# Altium schematic sheet Audio-Amplifier.SchDoc
size A4; DocumentNumber: 5; SheetNumber: 5; SheetTotal: 5
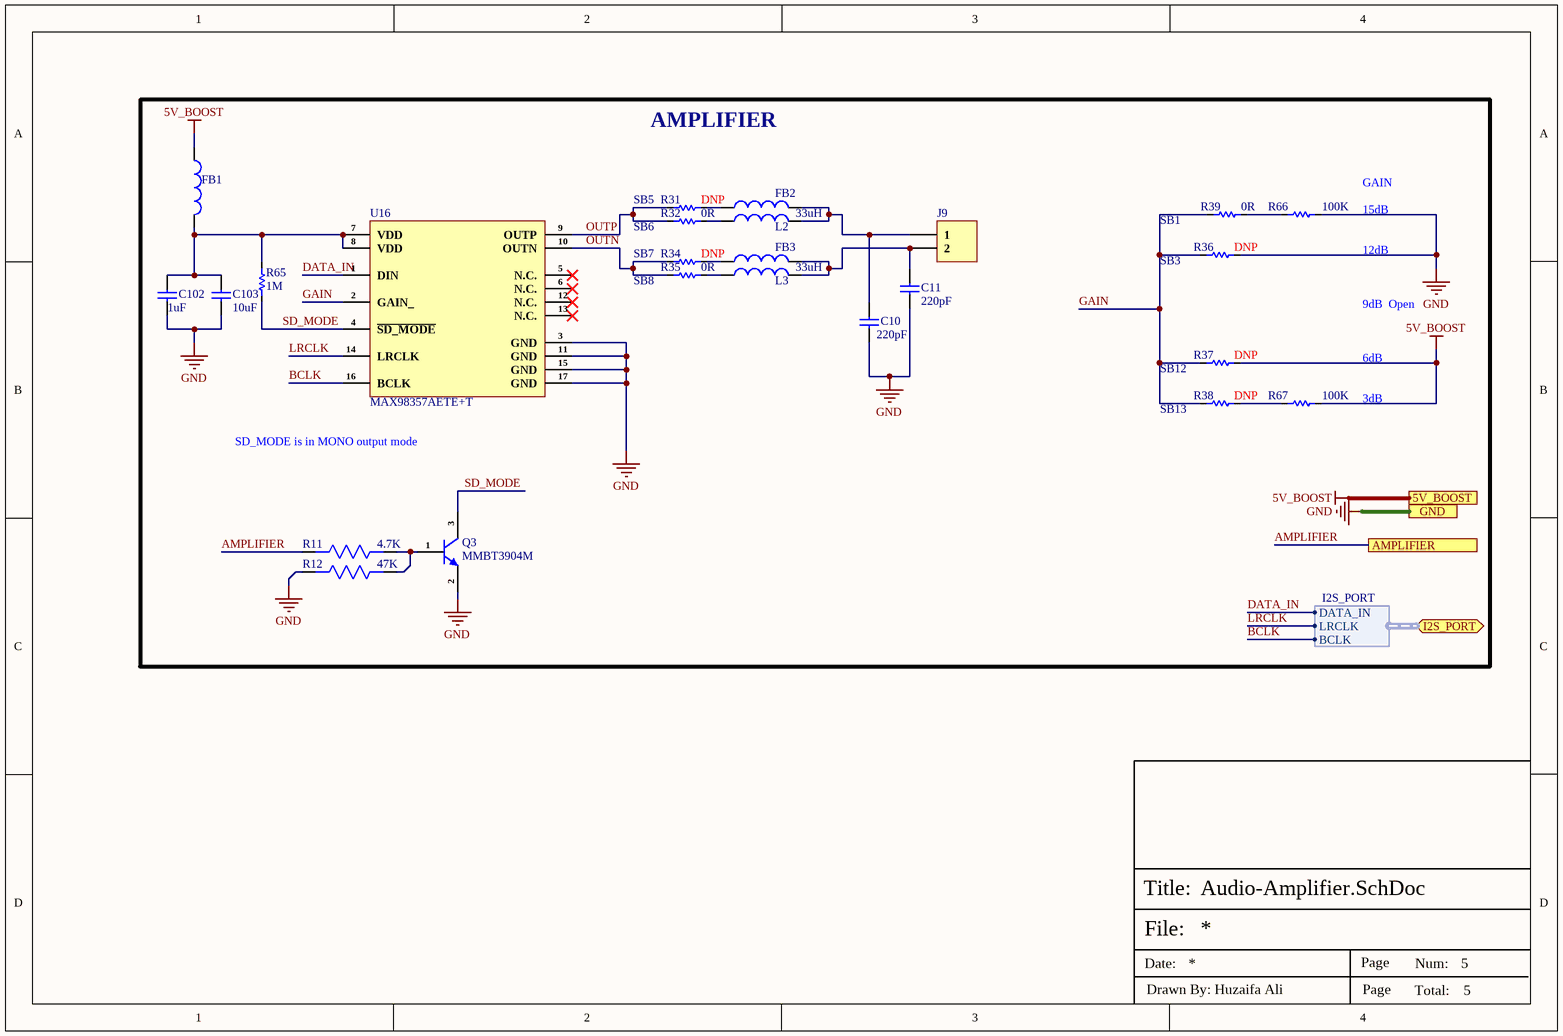
[diagram p0: Audio-Amplifier.SchDoc]

## Parts
C10  220pF  [Cap-0402]
C11  220pF  [Cap-0402]
C102  1uF  [Cap-0603]
C103  10uF  [Cap-0805]
FB1  BLM18PG300SN1D  [IND-0603 (1608 Metric)]  (value not drawn)
FB2  BLM18PG300SN1D  [IND-0603 (1608 Metric)]  (value not drawn)
FB3  BLM18PG300SN1D  [IND-0603 (1608 Metric)]  (value not drawn)
J9  61300211121  [HDR1X2_]  (value not drawn)
L2  33uH  [VLCF5024T-330MR50-2]
L3  33uH  [VLCF5024T-330MR50-2]
Q3  MMBT3904M  [SOT-723]
R11  4.7K  [Res-0603]
R12  47K  [Res-0603]
R31  DNP  [Res-0603]
R32  0R  [Res-0603]
R34  DNP  [Res-0603]
R35  0R  [Res-0603]
R36  DNP  [Res-0603]
R37  DNP  [Res-0603]
R38  DNP  [Res-0603]
R39  0R  [Res-0603]
R65  1M  [Res-0603]
R66  100K  [Res-0603]
R67  100K  [Res-0603]
U16  MAX98357AETE+T  [TQFN-16-EP(3x3)]

## Ports
5V_BOOST, AMPLIFIER, GND, I2S_PORT (bidir, harness I2S_PORT)

## Harnesses
I2S_PORT: DATA_IN, LRCLK, BCLK

## Nets
5V_BOOST: FB1.1 R37.2 R67.2 ; port 5V_BOOST
GND: C10.1 C11.1 C102.1 C103.1 Q3.2(E) R12.2 R36.2 R66.2 U16.3(GND) U16.11(GND) U16.15(GND) U16.17(GND) ; port GND
AMPLIFIER: R11.2 ; port AMPLIFIER
BCLK: U16.16(BCLK) ; port I2S_PORT.BCLK
DATA_IN: U16.1(DIN) ; port I2S_PORT.DATA_IN
GAIN: R36.1 R37.1 R38.1 R39.1 U16.2(GAIN_)
LRCLK: U16.14(LRCLK) ; port I2S_PORT.LRCLK
OUTN: R34.1 R35.1 U16.10(OUTN)
OUTP: R31.1 R32.1 U16.9(OUTP)
SD_MODE: Q3.3(C) R65.1 U16.4(~{SD_MODE})
NetC10_2: C10.2 FB2.2 J9.1 L2.2
NetC11_2: C11.2 FB3.2 J9.2 L3.2
NetC102_2: C102.2 C103.2 FB1.2 R65.2 U16.7(VDD) U16.8(VDD)
NetFB2_1: FB2.1 R31.2
NetFB3_1: FB3.1 R34.2
NetL2_1: L2.1 R32.2
NetL3_1: L3.1 R35.2
NetQ3_1: Q3.1(B) R11.1 R12.1
NetR38_2: R38.2 R67.1
NetR39_2: R39.2 R66.1

Not connected (* = marked no-connect by the designer): U16 5(N.C.)* 6(N.C.)* 12(N.C.)* 13(N.C.)*

## Notes on the sheet
- AMPLIFIER
- SB5
- SB6
- SB1
- SB7
- SB8
- (near R36) SB3
- SB12
- (near U16) SD_MODE is in MONO output mode
- (near R38) SB13
- GAIN
  15dB
  12dB
  9dB  Open
  6dB
  3dB
- File:
- Title:
- Date:
- Page
- Num:
- Total:
- Drawn By: Huzaifa Ali

## Library data of the parts
C10 C11 = CC0402JRNPO9BN221: CAP CER 220PF 50V C0G/NPO 0402; Manufacturer: Yageo; Dielectric Material: Ceramic; Tolerance: 10%; Dielectric: C0G; Temperature Coefficient: 30ppm/°C; Insulation Resistance: 10GR; Dissipation Factor: 0.1%; Supplier 1: RSComponents; Manufacturer Part Number: CC0402JRNPO9BN221; RoHS: Yes; Category: Ceramic Capacitors; Stock 1: 20000; Pricing 1: 10000=0.00600, 100000=0.00600 (GBP); Mount: Surface Mount; Case/Package: 0402; Number of Pins: 2; Case Code (Metric): 1005; Case Code (Imperial): 0402; Min Operating Temperature: -55°C; Max Operating Temperature: 125°C; Capacitance: 220pF; Package Quantity: 1; Voltage Rating: 50V; Packaging: Tape and Reel; Termination: SMD/SMT; Voltage: 50V; Series: CC; Length: 1mm; Width: 0.02inch; Height: 0.5mm; Thickness: 0.022inch; Depth: 0.5mm; Radiation Hardening: No; RoHS Compliant: Yes; REACH SVHC: No SVHC; Lead Free: Lead Free; ComponentLink1URL: https://datasheet.ciiva.com/11786/0900766b8079c870-11786154.pdf?src-supplier=RSComponents; ComponentLink1Description: https://datasheet.ciiva.com/11786/0900766b8079c870-11786154.pdf?src-supplier=RSComponents; ComponentLink2URL: https://datasheet.ciiva.com/7656/1132289-7656616.pdf?src-supplier=Element14; ComponentLink2Description: https://datasheet.ciiva.com/7656/1132289-7656616.pdf?src-supplier=Element14; ComponentLink3URL: https://datasheet.ciiva.com/8033/1443161-8033609.pdf?src-supplier=Element14; ComponentLink3Description: https://datasheet.ciiva.com/8033/1443161-8033609.pdf?src-supplier=Element14; ComponentLink4URL: https://datasheet.ciiva.com/8033/1443161-8033608.pdf?src-supplier=Element14; ComponentLink4Description: https://datasheet.ciiva.com/8033/1443161-8033608.pdf?src-supplier=Element14; ComponentLink5URL: https://datasheet.ciiva.com/176/mlccorderingcode-176384.pdf?src-supplier=Digi-Key; ComponentLink5Description: https://datasheet.ciiva.com/176/mlccorderingcode-176384.pdf?src-supplier=Digi-Key; ComponentLink6URL: https://datasheet.ciiva.com/176/mlccorderingcode-176383.pdf?src-supplier=Digi-Key; ComponentLink6Description: https://datasheet.ciiva.com/176/mlccorderingcode-176383.pdf?src-supplier=Digi-Key; ComponentLink7URL: https://datasheet.ciiva.com/176/mlccorderingcode-176385.pdf?src-supplier=Digi-Key; ComponentLink7Description: https://datasheet.ciiva.com/176/mlccorderingcode-176385.pdf?src-supplier=Digi-Key; ComponentLink8URL: https://datasheet.ciiva.com/17434/upy-gp-np0-16v-to-50v-8-17434343.pdf?src-supplier=Avnet+Europe; ComponentLink8Description: https://datasheet.ciiva.com/17434/upy-gp-np0-16v-to-50v-8-17434343.pdf?src-supplier=Avnet+Europe; Supplier Part Number 1: 6169284; LCSC Part Number: C107001
C102 = CC0603KRX5R8BB105: CAP CER 1UF 25V X5R 0603; Manufacturer: Yageo; Tolerance: 10%; Item Type: Capacitor; Supplier 1: Digi-Key; Manufacturer Part Number: CC0603KRX5R8BB105; RoHS: Yes; Category: Ceramic Capacitors; Stock 1: 919939; Pricing 1: 1=0.12000, 10=0.08400, 50=0.04760, 100=0.03940, 500=0.02764, 1000=0.02288 (USD); Mount: Surface Mount; Case/Package: 0603; Number of Pins: 2; Case Code (Metric): 1608; Case Code (Imperial): 0603; Min Operating Temperature: -55°C; Max Operating Temperature: 85°C; Capacitance: 1uF; Dielectric: X5R; Package Quantity: 1; Voltage Rating: 25V; Packaging: Tape and Reel; Termination: SMD/SMT; Voltage Rating (DC): 25V; Series: CC; Construction: Flat; Length: 1.6mm; Width: 0.031inch; Height: 0.8mm; Thickness: 0.035inch; Depth: 0.8mm; Radiation Hardening: No; REACH SVHC: No SVHC; Lead Free: Lead Free; Halogen Free: Halogen Free; RoHS Compliant: Yes; ComponentLink1URL: https://datasheet.ciiva.com/176/mlccorderingcode-176785.pdf?src-supplier=Digi-Key; ComponentLink1Description: https://datasheet.ciiva.com/176/mlccorderingcode-176785.pdf?src-supplier=Digi-Key; ComponentLink2URL: https://datasheet.ciiva.com/176/mlccorderingcode-176786.pdf?src-supplier=Digi-Key; ComponentLink2Description: https://datasheet.ciiva.com/176/mlccorderingcode-176786.pdf?src-supplier=Digi-Key; ComponentLink3URL: https://datasheet.ciiva.com/176/mlccorderingcode-176787.pdf?src-supplier=Digi-Key; ComponentLink3Description: https://datasheet.ciiva.com/176/mlccorderingcode-176787.pdf?src-supplier=Digi-Key; ComponentLink4URL: https://datasheet.ciiva.com/17436/upy-gphc-x5r-4v-to-50v-12-17436952.pdf?src-supplier=Avnet+Europe; ComponentLink4Description: https://datasheet.ciiva.com/17436/upy-gphc-x5r-4v-to-50v-12-17436952.pdf?src-supplier=Avnet+Europe; ComponentLink5URL: https://datasheet.ciiva.com/7978/1525783-7978171.pdf?src-supplier=Element14; ComponentLink5Description: https://datasheet.ciiva.com/7978/1525783-7978171.pdf?src-supplier=Element14; ComponentLink6URL: https://datasheet.ciiva.com/11586/upy-gphc-x5r-4v-to-50v-12-11586318.pdf?src-supplier=Avnet; ComponentLink6Description: https://datasheet.ciiva.com/11586/upy-gphc-x5r-4v-to-50v-12-11586318.pdf?src-supplier=Avnet; Supplier Part Number 1: 311-1445-1-ND; LCSC Part Number: C14664
C103 = CC0805KKX5R8BB106: CAP CER 10UF 25V X5R 0805; Manufacturer: Yageo; Tolerance: 10%; Item Type: Capacitor; Supplier 1: Digi-Key; Manufacturer Part Number: CC0805KKX5R8BB106; RoHS: Yes; Category: Ceramic Capacitors; Stock 1: 554290; Pricing 1: 1=0.31000, 10=0.21200, 50=0.14820, 100=0.12710, 500=0.09534, 1000=0.08050 (USD); Mount: Surface Mount; Case/Package: 0805; Case Code (Imperial): 0805; Case Code (Metric): 2012; Weight: 0.000194oz; Min Operating Temperature: -55°C; Max Operating Temperature: 85°C; Capacitance: 10uF; Voltage Rating (DC): 25V; Packaging: Tape and Reel; Voltage Rating: 25V; Dielectric: X5R; Termination: SMD/SMT; Resistor Type: Ceramic; Series: CC; Length: 0.079inch; Width: 0.049inch; Thickness: 0.057inch; Depth: 1.25mm; Lead Free: Lead Free; Halogen Free: Halogen Free; RoHS Compliant: Yes; ComponentLink1URL: http://www.mouser.com/ds/2/447/UPY-GPHC_X5R_4V-to-50V_25-1131599.pdf?src-supplier=Mouser; ComponentLink1Description: http://www.mouser.com/ds/2/447/UPY-GPHC_X5R_4V-to-50V_25-1131599.pdf?src-supplier=Mouser; ComponentLink2URL: http://www.yageo.com/documents/recent/UPY-GPHC_X5R_4V-to-50V_25.pdf?src-supplier=Digi-Key; ComponentLink2Description: http://www.yageo.com/documents/recent/UPY-GPHC_X5R_4V-to-50V_25.pdf?src-supplier=Digi-Key; Supplier Part Number 1: 311-1869-1-ND; LCSC Part Number: C89831
FB1-FB3 = BLM18PG300SN1D: FERRITE BEAD 30 OHM 0603 1LN / Ferrite Beads Multi-Layer 30Ohm 100MHz 1A 0.05Ohm DCR 0603 T/R; Manufacturer: Murata; Material: Steel,Ferrite; Impedance: 30R; Tolerance: 25%; DC Resistance (DCR): 50mR; Number of Lines: 1; Shielding: Unshielded; Supplier 1: RSComponents; Manufacturer Part Number: BLM18PG300SN1D; RoHS: Yes; Category: Inductors; Stock 1: 3100; Pricing 1: 25=0.07200, 1000=0.06200, 2000=0.05400, 5000=0.04700, 10000=0.04300 (GBP); Case/Package: 0603; Number of Pins: 2; Core Material: Ferrite; Case Code (Metric): 1608; Case Code (Imperial): 0603; Min Operating Temperature: -55°C; Max Operating Temperature: 125°C; Package Quantity: 4000; Max Current Rating: 1A; Packaging: Tape and Reel; Current Rating: 1A; Max DC Current: 1A; Termination: SMD/SMT; Test Frequency: 100MHz; DC Current: 1A; Frequency: 100MHz; Number of Circuits: 1; Series: BLM18P; DC Resistance-Max: 50mR; Length: 1.6mm; Width: 0.8mm; Height: 0.8mm; Depth: 0.8mm; Radiation Hardening: No; REACH SVHC: No SVHC; Lead Free: Lead Free; RoHS Compliant: Yes; ComponentLink1URL: https://datasheet.ciiva.com/19460/1845048-19460200.pdf?src-supplier=Jameco; ComponentLink1Description: https://datasheet.ciiva.com/19460/1845048-19460200.pdf?src-supplier=Jameco; ComponentLink2URL: https://datasheet.ciiva.com/11800/0900766b81275ca5-11800868.pdf?src-supplier=RSComponents; ComponentLink2Description: https://datasheet.ciiva.com/11800/0900766b81275ca5-11800868.pdf?src-supplier=RSComponents; ComponentLink3URL: https://datasheet.ciiva.com/8021/5148-8021484.pdf?src-supplier=Element14; ComponentLink3Description: https://datasheet.ciiva.com/8021/5148-8021484.pdf?src-supplier=Element14; ComponentLink4URL: https://datasheet.ciiva.com/8021/5148-8021486.pdf?src-supplier=Element14; ComponentLink4Description: https://datasheet.ciiva.com/8021/5148-8021486.pdf?src-supplier=Element14; ComponentLink5URL: https://datasheet.ciiva.com/1012/l0110s0100blm18p-1012120.pdf?src-supplier=Digi-Key; ComponentLink5Description: https://datasheet.ciiva.com/1012/l0110s0100blm18p-1012120.pdf?src-supplier=Digi-Key; ComponentLink6URL: https://datasheet.ciiva.com/1012/l0110s0100blm18p-1012119.pdf?src-supplier=Digi-Key; ComponentLink6Description: https://datasheet.ciiva.com/1012/l0110s0100blm18p-1012119.pdf?src-supplier=Digi-Key; ComponentLink7URL: https://datasheet.ciiva.com/1012/l0110s0100blm18p-1012121.pdf?src-supplier=Digi-Key; ComponentLink7Description: https://datasheet.ciiva.com/1012/l0110s0100blm18p-1012121.pdf?src-supplier=Digi-Key; ComponentLink8URL: https://datasheet.ciiva.com/3081/l0110s0100blm18p-3081636.pdf?src-supplier=Avnet; ComponentLink8Description: https://datasheet.ciiva.com/3081/l0110s0100blm18p-3081636.pdf?src-supplier=Avnet; Supplier Part Number 1: 7241403; LCSC Part Number: C17305; Item Type: Ferrite Bead
J9 = 61300211121: CONN HEADER VERT 2POS 2.54MM; Manufacturer: Wurth Electronics; Current Rating: 3A; Voltage Rating: 250V; Number of Positions: 2; Gender: Male; Connector Type: Male Pin; Pitch: 0.1inch; Supplier 1: Digi-Key; Manufacturer Part Number: 61300211121; Stock 1: 219205; Pricing 1: 1=0.13, 10=0.106, 25=0.088, 50=0.074, 100=0.067, 1000=0.061 (USD); Mount: Through Hole; Contact Plating: Gold; Housing Material: PBT; Contact Material: Copper Alloy,Copper; Color: Black; Min Operating Temperature: -40°C; Max Operating Temperature: 125°C; Number of Rows: 1; Contact Gender: Male; Packaging: Bulk; Termination: Through Hole; Number of Contacts: 2; Contact Mating Length: 0.236inch; REACH SVHC: Unknown; Lead Free: Lead Free; ComponentLink1URL: http://www.mouser.com/ds/2/445/6130xx11121-538006.pdf?src-supplier=Mouser; ComponentLink1Description: http://www.mouser.com/ds/2/445/6130xx11121-538006.pdf?src-supplier=Mouser; Supplier Part Number 1: 732-5315-ND; Item Type: Header
L2 L3 = VLCF5024T-330MR50-2: FIXED IND 33UH 500MA 275MOHM SMD; Manufacturer: TDK; Core Material: Ferrite; Tolerance: 20%; Shielding: Shielded; DC Resistance (DCR): 275mR; Test Frequency: 100kHz; RMS Current (Irms): 1.24A; Item Type: Inductor; Supplier 1: Mouser; Manufacturer Part Number: VLCF5024T-330MR50-2; RoHS: Yes; Category: Fixed Inductors; Stock 1: 559; Pricing 1: 1=1.23000, 10=0.91900, 50=0.91900, 100=0.77200, 1000=0.57700, 10000=0.53200 (USD); Mounting Technology: Surface Mount; Case/Package: Nonstandard; Min Operating Temperature: -40°C; Max Operating Temperature: 105°C; Packaging: Cut Tape; Inductance Tolerance: 20%; Package Quantity: 500; Current Rating: 500mA; Saturation Current: 500mA; Resistor Type: Wirewound; Value: 33uH; Max DC Current: 500mA; Series: VLCF; Length: 0.197inch; Width: 0.197inch; Height: 2.4mm; Height - Seated (Max): 0.094inch; Reach SVHC Compliant: Yes; RoHS Compliant: Yes; ComponentLink1URL: https://datasheet.ciiva.com/22729/1724253-22729224.pdf?src-supplier=Element14; ComponentLink1Description: https://datasheet.ciiva.com/22729/1724253-22729224.pdf?src-supplier=Element14; Supplier Part Number 1: 810-VLCF524T330MR502; LCSC Part Number: C2046704
Q3 = MMBT3904M: 40V 100mW 100@10mA,1V 200mA 300MHz 300mV@50mA,5mA NPN -55℃~+150℃@(Tj) SOT-723 Bipolar Transistors - BJT ROHS; Manufacturer: TECH PUBLIC; Item Type: Mosfet; ComponentLink1Description: LCSC; ComponentLink1URL: https://www.lcsc.com/product-detail/Bipolar-Transistors-BJT_TECH-PUBLIC-MMBT3904M_C2923360.html; Manufacturer Part Number: MMBT3904M; Package: SOT-723; LCSC Part Number: C2923360
R11 = RC0603JR-074K7L: RES SMD 4.7K OHM 5% 1/10W 0603; Manufacturer: Yageo; Resistance: 4.7kR; Temperature Coefficient: 100ppm/°C; Voltage Rating (DC): 50V; Power Rating: 100mW; Supplier 1: Digi-Key; Manufacturer Part Number: RC0603JR-074K7L; Stock 1: 19706643; Pricing 1: 1=0.1, 10=0.02, 100=0.0081, 1000=0.00362, 2500=0.00314 (USD); Case/Package: 0603; Number of Pins: 2; Case Code (Imperial): 0603; Case Code (Metric): 1608; Min Operating Temperature: -55°C; Max Operating Temperature: 155°C; Tolerance: 5%; Composition: Thick Film; Packaging: Tape and Reel; Voltage Rating: 50V; Termination: SMD/SMT; Military Standard: Not; Length: 1.6mm; Width: 0.8mm; Depth: 0.8mm; REACH SVHC: No SVHC; Lead Free: Lead Free; ComponentLink1URL: http://www.farnell.com/datasheets/443971.pdf?src-supplier=Element14; ComponentLink1Description: http://www.farnell.com/datasheets/443971.pdf?src-supplier=Element14; Supplier Part Number 1: 311-4.7KGRCT-ND; LCSC Part Number: C105428
R12 = RC0603JR-0747KL: RES 47K OHM 5% 1/10W 0603; Manufacturer: Yageo; Resistance: 47kR; Power Rating: 100mW; Voltage Rating (DC): 50V; Temperature Coefficient: 100ppm/°C; Resistance Tolerance: 1%; Supplier 1: Arrow; Manufacturer Part Number: RC0603JR-0747KL; Stock 1: 599135; Pricing 1: 5000=0.0025, 10000=0.0022, 25000=0.0019, 1=0.0011, 6000=0.001 (USD); Case/Package: 0603; Number of Pins: 2; Case Code (Imperial): 0603; Case Code (Metric): 1608; Min Operating Temperature: -55°C; Max Operating Temperature: 155°C; Packaging: Tape and Reel; Tolerance: 5%; Voltage Rating: 50V; Package Quantity: 5000; Termination: SMD/SMT; Military Standard: Not; Composition: Thick Film; Length: 1.6mm; Height: 0.45mm; Width: 0.8mm; Depth: 0.8mm; REACH SVHC: No SVHC; Lead Free: Lead Free; ComponentLink1URL: http://www.farnell.com/datasheets/443971.pdf; ComponentLink1Description: http://www.farnell.com/datasheets/443971.pdf; ComponentLink2URL: http://www.mouser.com/catalog/specsheets/RC0603.pdf; ComponentLink2Description: http://www.mouser.com/catalog/specsheets/RC0603.pdf; Supplier Part Number 1: RC0603JR-0747KL; Supplier 2: Digi-Key; RoHS: Yes; Category: Chip SMD Resistors; Stock 2: 1087850; Pricing 2: 1=0.10000, 10=0.02300, 100=0.00930, 1000=0.00417, 2500=0.00362 (USD); Size Code: 0603; Number of Terminations: 2; Resistor Type: Thick Film; Features: Moisture Resistant; Series: RC; Max Power Dissipation: 100mW; Construction: Rectangular; RoHS Compliant: Yes; ComponentLink3URL: https://datasheet.ciiva.com/46395/443971-46395003.pdf?src-supplier=Element14; ComponentLink3Description: https://datasheet.ciiva.com/46395/443971-46395003.pdf?src-supplier=Element14; ComponentLink4URL: https://datasheet.ciiva.com/12558/rc0603-272842-12558744.pdf?src-supplier=Mouser; ComponentLink4Description: https://datasheet.ciiva.com/12558/rc0603-272842-12558744.pdf?src-supplier=Mouser; Supplier Part Number 2: 311-30.0KHRCT-ND; LCSC Part Number: C127447
R31 R32 R34-R39 = RC0603FR-070RL: RES SMD 0R, 1%, 0.1W, 0603; Manufacturer: Yageo; Item Type: Resistor; Manufacturer Part Number: RC0603FR-070RL; Package: 0603; LCSC Part Number: C100044; ComponentLink9Description: LCSC; ComponentLink9URL: https://www.lcsc.com/product-detail/Chip-Resistor-Surface-Mount_YAGEO-RC0603FR-070RL_C100044.html
R65 = RC0603FR-071ML: RES SMD 1M OHM 1% 1/10W 0603; Manufacturer: Yageo; Voltage Rating: 50V; Resistance: 1MR; Power Rating: 100mW; Temperature Coefficient: 100ppm/°C; Supplier 1: Digi-Key; Manufacturer Part Number: RC0603FR-071ML; Stock 1: 3824601; Pricing 1: 1=0.1, 10=0.023, 100=0.0094, 1000=0.00421, 2500=0.00366 (USD); Case/Package: 0603; Number of Pins: 2; Case Code (Imperial): 0603; Case Code (Metric): 1608; Min Operating Temperature: -55°C; Max Operating Temperature: 155°C; Voltage Rating (DC): 50V; Tolerance: 1%; Packaging: Tape and Reel; Package Quantity: 5000; Termination: SMD/SMT; Composition: Thick Film; Military Standard: Not; Length: 1.6mm; Height: 0.45mm; Width: 0.8mm; Depth: 0.8mm; REACH SVHC: No SVHC; Lead Free: Lead Free; ComponentLink1URL: http://www.farnell.com/datasheets/2167052.pdf?src-supplier=Mouser; ComponentLink1Description: http://www.farnell.com/datasheets/2167052.pdf?src-supplier=Mouser; ComponentLink2URL: http://www.farnell.com/datasheets/2167052.pdf?src-supplier=Element14; ComponentLink2Description: http://www.farnell.com/datasheets/2167052.pdf?src-supplier=Element14; ComponentLink3URL: http://documents.rs-components.com/techlib://itc_doclist_GB.htm?stockno=5048956&src-supplier=RSComponents; ComponentLink3Description: http://documents.rs-components.com/techlib://itc_doclist_GB.htm?stockno=5048956&src-supplier=RSComponents; Supplier Part Number 1: 311-1.00MHRDKR-ND; LCSC Part Number: C105578
R66 R67 = RT0603BRD07100KL: RES SMD 100K OHM 0.1% 1/10W 0603; Manufacturer: Yageo; Resistance: 100kR; Temperature Coefficient: 25ppm/°C; Voltage Rating (DC): 75V; Power Rating: 100mW; Item Type: Resistor; Supplier 1: Digi-Key; Manufacturer Part Number: RT0603BRD07100KL; Stock 1: 53395; Pricing 1: 1=0.39, 10=0.332, 100=0.1298, 1000=0.05435, 2500=0.04982 (USD); Mount: Surface Mount; Case/Package: 0603; Case Code (Imperial): 0603; Case Code (Metric): 1608; Min Operating Temperature: -55°C; Max Operating Temperature: 125°C; Tolerance: 0.1%; Composition: Thin Film; Packaging: Tape and Reel; Voltage Rating: 75V; Package Quantity: 5000; Termination: SMD/SMT; Number of Terminations: 2; Military Standard: Not; Max Power Dissipation: 100mW; Working Voltage: 75V; Features: Moisture Resistant; Length: 1.6mm; Height: 0.022inch; Width: 0.031inch; Depth: 0.8mm; Lead Free: Lead Free; ComponentLink1URL: http://documents.rs-components.com/techlib://itc_doclist_GB.htm?stockno=6174810&src-supplier=RSComponents; ComponentLink1Description: http://documents.rs-components.com/techlib://itc_doclist_GB.htm?stockno=6174810&src-supplier=RSComponents; Supplier Part Number 1: YAG1235CT-ND; LCSC Part Number: C122538
U16 = MAX98357AETE+T: Audio Amplifier, 1 Func, PQCC16; Manufacturer: Maxim; Package Body Material: Plastic; Channels: 1; Package Equivalence Code: LCC16,.12SQ,20; Power Supplies: 5V; Max Supply Current: 3mA; Qualification Status: Not Qualified; Item Type: IC; Supplier 1: Arrow Electronics; Manufacturer Part Number: MAX98357AETE+T; RoHS: Yes; Category: Amplifiers - Audio; Stock 1: 2; Pricing 1: 1=2.83800 (USD); Case/Package: QCCN; Pins: 16; Package Shape: Square; Min Operating Temperature: -40°C; Max Operating Temperature: 85°C; Consumer IC Type: AUDIO AMPLIFIER; JESD-30 Code: S-PQCC-N16; Moisture Sensitivity Level: 1; Package Style: CHIP CARRIERMeter; Surface Mount: Yes; Terminal Form: No Lead; Terminal Position: QUAD; Terminal Pitch: 0.5mm; Temperature Grade: INDUSTRIAL; Reach SVHC Compliant: Yes; RoHS Compliant: Yes; ComponentLink1URL: https://datasheet.ciiva.com:443/pdfs/VipMasterIC/IC/MAXM/MAXM-S-A0007997446/MAXM-S-A0007997446-1.pdf?src-supplier=IHS+Markit; ComponentLink1Description: https://datasheet.ciiva.com:443/pdfs/VipMasterIC/IC/MAXM/MAXM-S-A0007997446/MAXM-S-A0007997446-1.pdf?src-supplier=IHS+Markit; ComponentLink2URL: https://datasheet.ciiva.com/29970/max98357a-max98357b-29970280.pdf?src-supplier=Avnet; ComponentLink2Description: https://datasheet.ciiva.com/29970/max98357a-max98357b-29970280.pdf?src-supplier=Avnet; Supplier Part Number 1: MAX98357AETE+T; LCSC Part Number: C910544